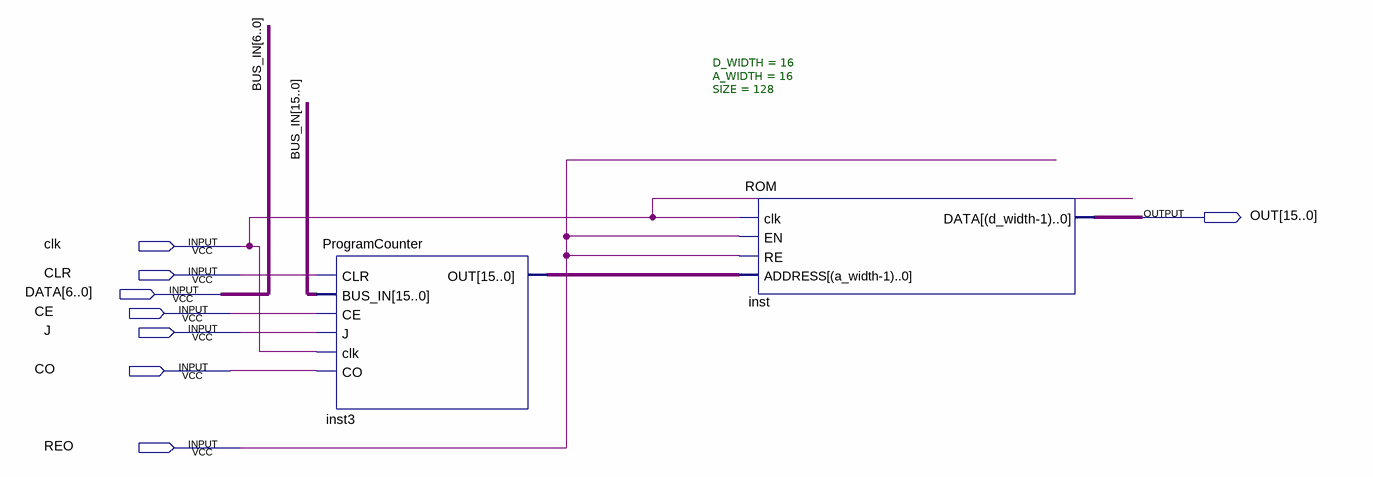
[diagram p0: schematic sheet]
// Quartus schematic ROMTest.bdf as structural Verilog: 2 symbols, 8 pins
module ROMTest (
  input  clk,
  input  CLR,
  input  [6:0] DATA,
  input  CE,
  input  J,
  input  CO,
  input  REO,
  output [15:0] OUT
);

  wire [15:0] inst3_out;
  wire [15:7] BUS_IN;

  ProgramCounter inst3 (.CLR(CLR), .BUS_IN({BUS_IN, DATA}), .CE(CE), .J(J), .clk(clk), .CO(CO), .OUT(inst3_out));
  ROM #(.D_WIDTH(16), .A_WIDTH(16), .SIZE(128)) inst (.clk(clk), .EN(REO), .RE(REO), .ADDRESS(inst3_out), .DATA(OUT));

  // Other names for the same wires on the sheet: BUS_IN[6:0] = DATA
endmodule
